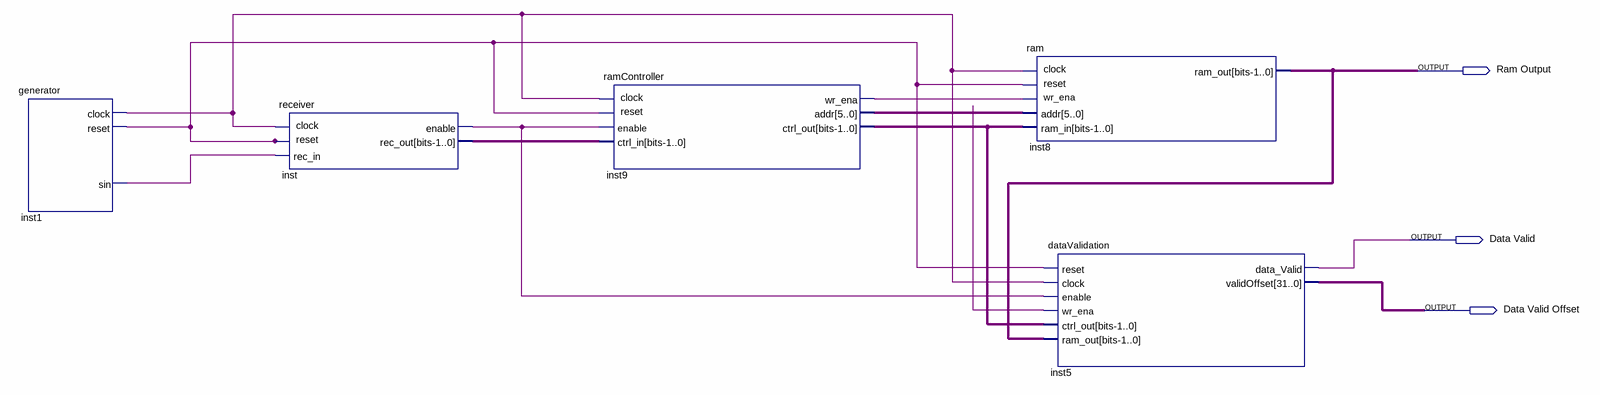
[diagram p0: schematic sheet]
// Quartus schematic ramIntroBlockDiagram.bdf as structural Verilog: 5 symbols, 3 pins
module ramIntroBlockDiagram (
  output \Ram_Output ,
  output \Data_Valid ,
  output \Data_Valid_Offset 
);

  wire inst1_clock, inst1_reset, inst1_sin, inst9_ctrl_out, inst9_wr_ena, inst_enable, inst_rec_out, undriven;
  wire [5:0] inst9_addr;
  wire [31:0] inst5_validoffset;

  generator inst1 (.clock(inst1_clock), .reset(inst1_reset), .sin(inst1_sin));
  receiver inst (
    .reset(inst1_clock), .clock(inst1_reset), .rec_in(inst1_sin), .enable(inst_enable), .rec_out(inst_rec_out));
  ramController inst9 (
    .reset(inst1_clock), .clock(inst1_reset), .enable(inst_enable), .ctrl_in(inst_rec_out),
    .addr(inst9_addr), .wr_ena(inst9_wr_ena), .ctrl_out(inst9_ctrl_out));
  ram inst8 (
    .wr_ena(inst1_clock), .clock(inst1_reset), .reset(inst9_wr_ena), .addr(inst9_addr),
    .ram_in(inst9_ctrl_out), .ram_out(\Ram_Output ));
  dataValidation inst5 (
    .reset(inst1_reset), .clock(inst1_clock), .enable(inst_enable), .wr_ena(undriven),
    .ctrl_out(inst9_ctrl_out), .ram_out(\Ram_Output ), .data_Valid(\Data_Valid ),
    .validOffset(inst5_validoffset));
endmodule
